# Altium schematic sheet Boost Converter Circuit.SchDoc
size B; Organization: Altium Limited; Address1: L3, 12a Rodborough Rd; Address2: Frenchs Forest; Address3: NSW; Address4: Australia 2086; SheetNumber: 1; SheetTotal: 1
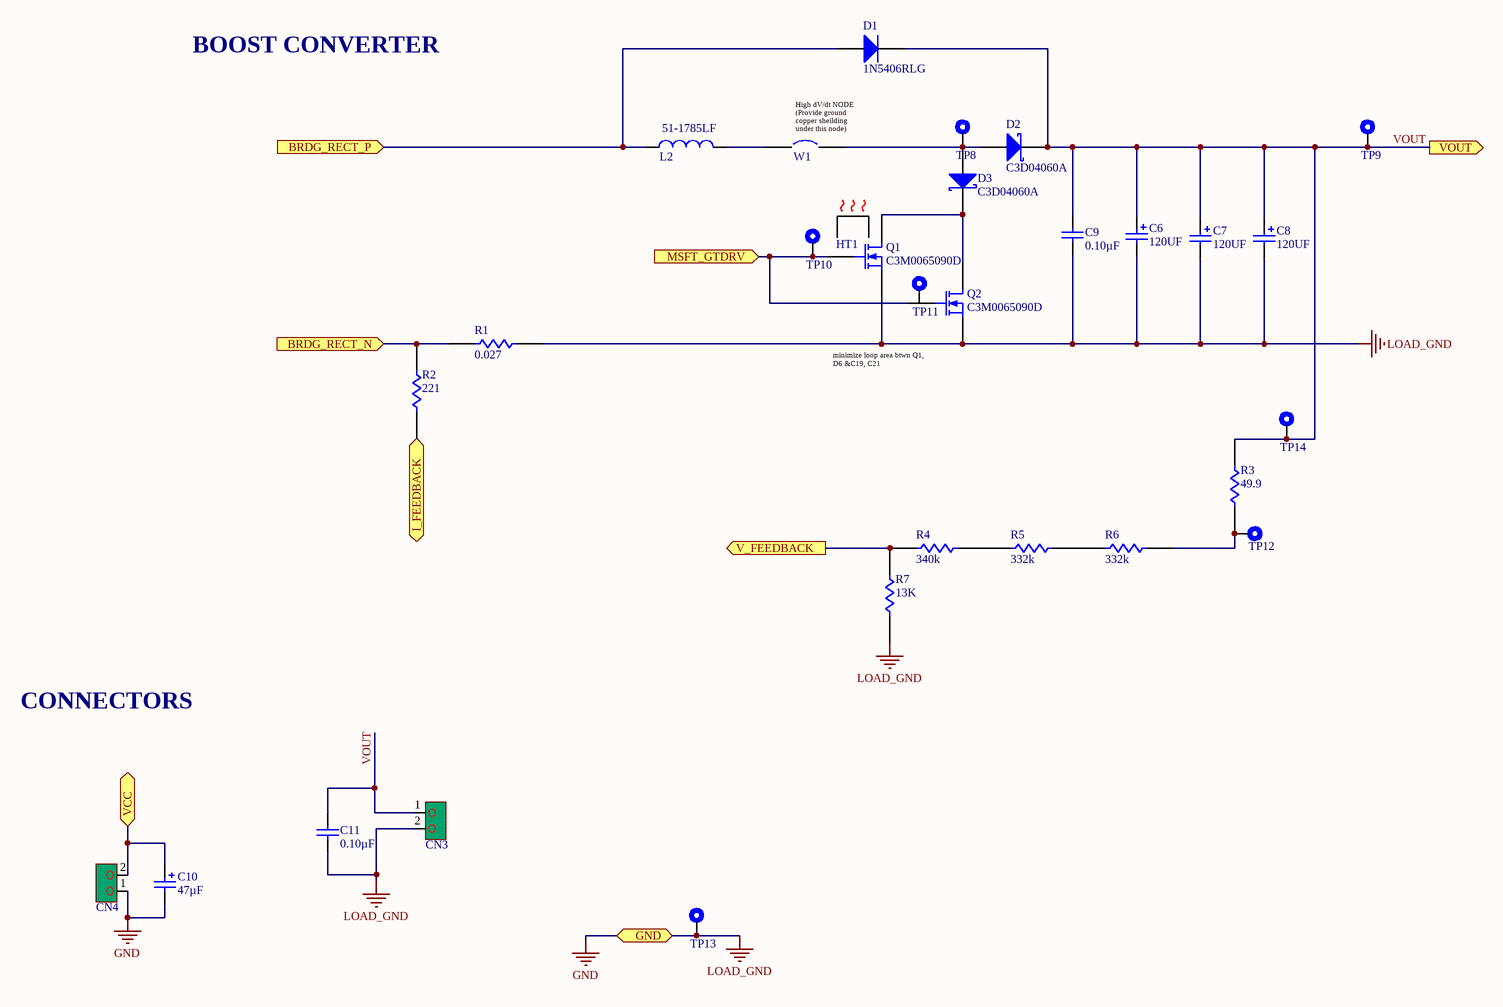
[diagram p0: Boost Converter Circuit.SchDoc]

## Parts
C6  Capacitance: 120UF  [450QXW120MEFC18X31.5]  (hidden comment: 450QXW120MEFC18X31.5)
C7  Capacitance: 120UF  [450QXW120MEFC18X31.5]  (hidden comment: 450QXW120MEFC18X31.5)
C8  Capacitance: 120UF  [450QXW120MEFC18X31.5]  (hidden comment: 450QXW120MEFC18X31.5)
C9  Capacitance: 0.10µF  [CAP1812]  (hidden comment: GRM43DR72J104KW01L)
C10  Capacitance: 47µF  [CAPALUM47U]  (hidden comment: ECA-1VM470)
C11  Capacitance: 0.10µF  [CAP1812]  (hidden comment: GRM43DR72J104KW01L)
CN3  1935776  [CONN_1935776]  (value not drawn)
CN4  1935776  [CONN_1935776]  (value not drawn)
D1  1N5406RLG  [1N5406-DO201AD]
D2  C3D04060A  [C3D04060A]
D3  C3D04060A  [C3D04060A]
HT1  HT_78245  [HT-78245]  (value not drawn)
L2  51-1785LF  [G-51-185LF]
Q1  C3M0065090D  [TO-247-3]
Q2  C3M0065090D  [TO-247-3]
R1  Resistance: 0.027  [RES2512]  (hidden comment: CRCW2512R0.027)
R2  Resistance: 221  [RES0805_New]  (hidden comment: RC0805FR-07221RL)
R3  Resistance (Ohms): 49.9  [RES1206]  (hidden comment: CRCW120649R9FKEA)
R4  Resistance (Ohms): 340k  [RES0805_New]  (hidden comment: CRCW0805340KFKEA)
R5  Resistance (Ohms): 332k  [RES0805_New]  (hidden comment: CRCW0805332KFKEA)
R6  Resistance (Ohms): 332k  [RES0805_New]  (hidden comment: CRCW0805332KFKEA)
R7  Resistance: 13K  [RES0805_New]  (hidden comment: RC0805FR-0713KL)
TP8  5006  [Test Point]  (value not drawn)
TP9  5006  [Test Point]  (value not drawn)
TP10  5006  [Test Point]  (value not drawn)
TP11  5006  [Test Point]  (value not drawn)
TP12  5006  [Test Point]  (value not drawn)
TP13  5006  [Test Point]  (value not drawn)
TP14  5006  [Test Point]  (value not drawn)
W1  Wire  [Current Sense Wire]  (value not drawn)

## Ports
BRDG_RECT_N (in), BRDG_RECT_P (in), GND, I_FEEDBACK, MSFT_GTDRV (in), V_FEEDBACK (out), VCC, VOUT (out)

## Nets
GND: C6.2 C7.2 C8.2 C9.1 C10.2 C11.1 CN3.2 CN4.1 Q1.3(S) Q2.3(S) R1.1 R7.2 TP13.1 ; port GND  [also labelled LOAD_GND]
BRDG_RECT_N: R1.2 R2.1 ; port BRDG_RECT_N
BRDG_RECT_P: D1.2(A) L2.1 ; port BRDG_RECT_P
I_FEEDBACK: R2.2 ; port I_FEEDBACK
MSFT_GTDRV: Q1.1(G) Q2.1(G) TP10.1 ; port MSFT_GTDRV
V_FEEDBACK: R4.2 R7.1 ; port V_FEEDBACK
VCC: C10.1 CN4.2 ; port VCC
VOUT: C6.1 C7.1 C8.1 C9.2 C11.2 CN3.1 D1.1(K) D2.1(K) R3.1 TP9.1 TP14.1 ; port VOUT
NetD2_2: D2.2(A) D3.2(A) TP8.1 W1.2
NetD3_1: D3.1(K) Q1.2(D) Q2.2(D)
NetL2_2: L2.2 W1.1
NetR3_2: R3.2 R6.1 TP12.1
NetR4_1: R4.1 R5.2
NetR5_1: R5.1 R6.2

Not connected (* = marked no-connect by the designer): TP11 1

## Notes on the sheet
- BOOST CONVERTER
- (near W1) High dV/dt NODE (Provide ground copper sheilding under this node)
- (near Q2) minimize loop area btwn Q1, D6 &C19, C21
- CONNECTORS
- Title:
- Size:
- B
- Document Number:
- Revision:
- Designer:
- Approval Date:
- Start Date:
- MM/DD/YY
- --/--/--
- Sheet:
- of
- Approver:
- CONFIDENTIAL
- Project Name/Number:

## Library data of the parts
C9 C11 = GRM43DR72J104KW01L: CAP CER 0.1UF 630V X7R 1812; Manufacturer 1: Murata Electronics North America; Category 1: Capacitors; Tolerance: ±10%; Supplier 1: Digi-Key; Supplier Part Number 1: 490-3518-1-ND; Manufacturer Part Number 1: GRM43DR72J104KW01L; RoHS 1: RoHS Compliant; Description 1: CAP CER 0.1UF 630V X7R 1812; Stock 1: 99604; Pricing 1: 1=0.84, 10=0.803, 50=0.4796, 100=0.3897, 250=0.32372, 500=0.29376 (USD); Packaging: Cut Tape (CT); Part Status: Active; Voltage - Rated: 630V; Temperature Coefficient: X7R; Operating Temperature: -55°C ~ 125°C; Features: -; Ratings: -; Applications: General Purpose; Mounting Type: Surface Mount, MLCC; Package / Case: 1812 (4532 Metric); Size / Dimension: 0.177" L x 0.126" W (4.50mm x 3.20mm); Height - Seated (Max): -; Thickness (Max): 0.087" (2.20mm); Lead Spacing: -; Lead Style: -; ComponentLink1URL: http://www.murata.com/~/media/webrenewal/support/library/catalog/products/capacitor/mlcc/c02e.pdf; ComponentLink1Description: http://www.murata.com/~/media/webrenewal/support/library/catalog/products/capacitor/mlcc/c02e.pdf
C10 = ECA-1VM470: CAP ALUM 47UF 20% 35V RADIAL; Manufacturer 1: Panasonic Electronic Components; Category 1: Capacitors; Lifetime @ Temp.: 2000 Hrs @ 85°C; Polarization: Polar; Ripple Current: 130mA @ 120Hz; Supplier 1: Digi-Key; Supplier Part Number 1: P5164-ND; Manufacturer Part Number 1: ECA-1VM470; RoHS 1: RoHS Compliant; Description 1: CAP ALUM 47UF 20% 35V RADIAL; Stock 1: 32051; Pricing 1: 1=0.19, 10=0.131, 25=0.0964, 50=0.0788, 100=0.0665, 250=0.05424, 500=0.0455, 1000=0.04025, 5000=0.035 (USD); Packaging: Bulk; Part Status: Active; Tolerance: ±20%; Voltage Rating: 35V; ESR (Equivalent Series Resistance): -; Operating Temperature: -40°C ~ 85°C; Applications: General Purpose; Impedance: -; Lead Spacing: 0.079" (2.00mm); Size / Dimension: 0.197" Dia (5.00mm); Height - Seated (Max): 0.472" (12.00mm); Surface Mount Land Size: -; Mounting Type: Through Hole; Package / Case: Radial, Can; ComponentLink1URL: http://industrial.panasonic.com/www-cgi/jvcr13pz.cgi?E+PZ+3+ABA0012+ECA1VM470+7+WW; ComponentLink1Description: http://industrial.panasonic.com/www-cgi/jvcr13pz.cgi?E+PZ+3+ABA0012+ECA1VM470+7+WW
CN3 CN4 = 1935776: CONN TERM BLOCK 2POS 5.0MM; Manufacturer 1: Phoenix Contact; Category 1: Connectors, Interconnects; Number of Levels: 1; Positions Per Level: 2; Pitch: 0.197" (5.00mm); Mating Orientation: Horizontal with Board; Current: 20A; Voltage: 300V; Wire Gauge: 12-20 AWG; Wire Termination: Screw; Torque - Screw: 0.45-0.5 Nm (3.9-4.4 Lb-In); Screw Thread: M3; Supplier 1: Digi-Key; Supplier Part Number 1: 277-6405-ND; Manufacturer Part Number 1: 1935776; RoHS 1: RoHS Compliant; Description 1: CONN TERM BLOCK 2POS 5.0MM; Stock 1: 5591; Pricing 1: 1=0.43, 10=0.411, 50=0.3928, 100=0.382, 250=0.357, 500=0.32844, 1000=0.2975 (USD); Packaging: Bulk; Part Status: Active; Mounting Type: Through Hole; Features: Interlocking (Side); Color: Green; Operating Temperature: -; Housing Material: Polyamide (PA), Nylon; Contact Material - Plating: -; Clamp Material - Plating: -; Screw Material - Plating: -; ComponentLink1URL: http://media.digikey.com/pdf/Data%20Sheets/Phoenix%20Contact%20PDFs/COMBICON%20Compact%20PT2,5.pdf; ComponentLink1Description: http://media.digikey.com/pdf/Data%20Sheets/Phoenix%20Contact%20PDFs/COMBICON%20Compact%20PT2,5.pdf
D1 = 1N5406RLG: DIODE GEN PURP 600V 3A DO201AD; Manufacturer: ON Semiconductor; Diode Type: Standard; Voltage - Forward (Vf) (Max) @ If: 1V @ 3A; Speed: Standard Recovery >500ns, > 200mA (Io); Current - Reverse Leakage @ Vr: 10µA @ 600V; Supplier 1: Digi-Key; RoHS: RoHS Compliant; Category: Discrete Semiconductor Products; Stock 1: 14400; Pricing 1: 1200=0.0966, 2400=0.08694, 6000=0.08211, 12000=0.07487, 30000=0.07004, 60000=0.06279 (USD); Packaging: Tape & Reel (TR); Part Status: Active; Capacitance @ Vr, F: -; Mounting Type: Through Hole; Package / Case: DO-201AA, DO-27, Axial; Supplier Device Package: DO-201AD; Operating Temperature - Junction: -65°C ~ 150°C; ComponentLink1URL: http://www.onsemi.com/pub_link/Collateral/1N5400-D.PDF; ComponentLink1Description: http://www.onsemi.com/pub_link/Collateral/1N5400-D.PDF; Supplier Part Number 1: 1N5406RLGOSTR-ND; Manufacturer Part Number: 1N5406RLG
D2 D3 = C3D04060A: DIODE SCHOTTKY 600V 4A TO220-2; Manufacturer 1: Cree/Wolfspeed; Category 1: Discrete Semiconductor Products; Diode Type: Silicon Carbide Schottky; Current - Average Rectified (Io): 4A (DC); Voltage - Forward (Vf) (Max) @ If: 1.8V @ 4A; Speed: No Recovery Time > 500mA (Io); Reverse Recovery Time (trr): 0ns; Current - Reverse Leakage @ Vr: 50µA @ 600V; Capacitance @ Vr, F: 251pF @ 0V, 1MHz; Supplier 1: Digi-Key; Supplier Part Number 1: C3D04060A-ND; RoHS 1: RoHS Compliant; Description 1: DIODE SCHOTTKY 600V 4A TO220-2; Stock 1: 1157; Pricing 1: 1=1.94, 100=1.62, 500=1.39, 1000=1.2125 (USD); Packaging: Tube; Part Status: Active; Voltage - DC Reverse (Vr) (Max): 600V; Mounting Type: Through Hole; Package / Case: TO-220-2; Supplier Device Package: TO-220-2; Operating Temperature - Junction: -55°C ~ 175°C; ComponentLink1URL: http://www.wolfspeed.com/media/downloads/845/C3D04060A.pdf; ComponentLink1Description: http://www.wolfspeed.com/media/downloads/845/C3D04060A.pdf; Manufacturer Part Number 1: C3D04060A
L2 = 51-1785LF: Manufacturer: Gowanda Electronics
Q1 Q2 = C3M0065090D: MOSFET N-CH 900V 36A TO247-3; Manufacturer 1: Cree/Wolfspeed; Category 1: Discrete Semiconductor Products; FET Type: N-Channel; Current - Continuous Drain (Id) @ 25°C: 36A (Tc); Drive Voltage (Max Rds On,  Min Rds On): 15V; Vgs(th) (Max) @ Id: 2.1V @ 5mA; Gate Charge (Qg) (Max) @ Vgs: 30.4nC @ 15V; Input Capacitance (Ciss) (Max) @ Vds: 660pF @ 600V; Vgs (Max): +18V, -8V; Power Dissipation (Max): 125W (Tc); Rds On (Max) @ Id, Vgs: 78 mOhm @ 20A, 15V; Supplier 1: Digi-Key; Supplier Part Number 1: C3M0065090D-ND; RoHS 1: RoHS Compliant; Description 1: MOSFET N-CH 900V 36A TO247-3; Stock 1: 4348; Pricing 1: 1=9.98, 100=9.62, 500=9.375 (USD); Packaging: Tube; Part Status: Active; Technology: SiCFET (Silicon Carbide); Drain to Source Voltage (Vdss): 900V; FET Feature: -; Operating Temperature: -55°C ~ 150°C (TJ); Mounting Type: Through Hole; Supplier Device Package: TO-247-3; Package / Case: TO-247-3; ComponentLink1URL: http://www.wolfspeed.com/media/downloads/176/C3M0065090D.pdf; ComponentLink1Description: http://www.wolfspeed.com/media/downloads/176/C3M0065090D.pdf; Manufacturer Part Number 1: C3M0065090D
R2 = RC0805FR-07221RL: RES SMD 221 OHM 1% 1/8W 0805; Manufacturer: Yageo; Power (Watts): 0.125W, 1/8W; Temperature Coefficient: ±100ppm/°C; Supplier 1: Digi-Key; Manufacturer Part Number: RC0805FR-07221RL; RoHS: RoHS Compliant; Category: Resistors; Stock 1: 823293; Pricing 1: 1=0.1, 10=0.022, 100=0.0088, 1000=0.00396, 2500=0.00344 (USD); Packaging: Cut Tape (CT); Part Status: Active; Tolerance: ±1%; Composition: Thick Film; Features: Moisture Resistant; Operating Temperature: -55°C ~ 155°C; Package / Case: 0805 (2012 Metric); Supplier Device Package: 0805; Size / Dimension: 0.079" L x 0.049" W (2.00mm x 1.25mm); Height - Seated (Max): 0.024" (0.60mm); Failure Rate: -; ComponentLink1URL: http://www.yageo.com/documents/recent/PYu-RC_Group_51_RoHS_L_7.pdf; ComponentLink1Description: http://www.yageo.com/documents/recent/PYu-RC_Group_51_RoHS_L_7.pdf; Supplier Part Number 1: 311-221CRCT-ND
R3 = CRCW120649R9FKEA: RES SMD 49.9 OHM 1% 1/4W 1206; Manufacturer 1: Vishay Dale; Category 1: Resistors; Power (Watts): 0.25W, 1/4W; Temperature Coefficient: ±100ppm/°C; Supplier 1: Digi-Key; Supplier Part Number 1: 541-49.9FCT-ND; Manufacturer Part Number 1: CRCW120649R9FKEA; RoHS 1: RoHS Compliant; Description 1: RES SMD 49.9 OHM 1% 1/4W 1206; Stock 1: 25160; Pricing 1: 1=0.1, 10=0.054, 25=0.0392, 50=0.03, 100=0.0221, 250=0.01684, 500=0.01346, 1000=0.00991 (USD); Packaging: Cut Tape (CT); Part Status: Active; Tolerance: ±1%; Composition: Thick Film; Features: Automotive AEC-Q200; Operating Temperature: -55°C ~ 155°C; Package / Case: 1206 (3216 Metric); Supplier Device Package: 1206; Size / Dimension: 0.126" L x 0.063" W (3.20mm x 1.60mm); Height - Seated (Max): 0.024" (0.60mm); Number of Terminations: 2; Failure Rate: -; ComponentLink1URL: http://www.vishay.com/docs/20035/dcrcwe3.pdf; ComponentLink1Description: http://www.vishay.com/docs/20035/dcrcwe3.pdf
R4 = CRCW0805340KFKEA: RES SMD 340K OHM 1% 1/8W 0805; Manufacturer 1: Vishay Dale; Category 1: Resistors; Power (Watts): 0.125W, 1/8W; Temperature Coefficient: ±100ppm/°C; Supplier 1: Digi-Key; Supplier Part Number 1: 541-340KCCT-ND; Manufacturer Part Number 1: CRCW0805340KFKEA; RoHS 1: RoHS Compliant; Description 1: RES SMD 340K OHM 1% 1/8W 0805; Stock 1: 2950; Pricing 1: 1=0.1, 10=0.04, 25=0.0288, 50=0.022, 100=0.0162, 250=0.01236, 500=0.0099, 1000=0.00729 (USD); Packaging: Cut Tape (CT); Part Status: Active; Tolerance: ±1%; Composition: Thick Film; Features: Automotive AEC-Q200; Operating Temperature: -55°C ~ 155°C; Package / Case: 0805 (2012 Metric); Supplier Device Package: 0805; Size / Dimension: 0.079" L x 0.049" W (2.00mm x 1.25mm); Height - Seated (Max): 0.020" (0.50mm); Number of Terminations: 2; Failure Rate: -; ComponentLink1URL: http://www.vishay.com/docs/20035/dcrcwe3.pdf; ComponentLink1Description: http://www.vishay.com/docs/20035/dcrcwe3.pdf
R5 R6 = CRCW0805332KFKEA: RES SMD 332K OHM 1% 1/8W 0805; Manufacturer 1: Vishay Dale; Category 1: Resistors; Power (Watts): 0.125W, 1/8W; Temperature Coefficient: ±100ppm/°C; Supplier 1: Digi-Key; Supplier Part Number 1: 541-332KCCT-ND; Manufacturer Part Number 1: CRCW0805332KFKEA; RoHS 1: RoHS Compliant; Description 1: RES SMD 332K OHM 1% 1/8W 0805; Stock 1: 14758; Pricing 1: 1=0.1, 10=0.04, 25=0.0288, 50=0.022, 100=0.0162, 250=0.01236, 500=0.0099, 1000=0.00729 (USD); Packaging: Cut Tape (CT); Part Status: Active; Tolerance: ±1%; Composition: Thick Film; Features: Automotive AEC-Q200; Operating Temperature: -55°C ~ 155°C; Package / Case: 0805 (2012 Metric); Supplier Device Package: 0805; Size / Dimension: 0.079" L x 0.049" W (2.00mm x 1.25mm); Height - Seated (Max): 0.020" (0.50mm); Number of Terminations: 2; Failure Rate: -; ComponentLink1URL: http://www.vishay.com/docs/20035/dcrcwe3.pdf; ComponentLink1Description: http://www.vishay.com/docs/20035/dcrcwe3.pdf
R7 = RC0805FR-0713KL: RES SMD 13K OHM 1% 1/8W 0805; Manufacturer: Yageo; Power (Watts): 0.125W, 1/8W; Temperature Coefficient: ±100ppm/°C; Supplier 1: Digi-Key; Manufacturer Part Number: RC0805FR-0713KL; RoHS: RoHS Compliant; Category: Resistors; Stock 1: 171259; Pricing 1: 1=0.1, 10=0.022, 100=0.0088, 1000=0.00396, 2500=0.00344 (USD); Packaging: Cut Tape (CT); Part Status: Active; Tolerance: ±1%; Composition: Thick Film; Features: Moisture Resistant; Operating Temperature: -55°C ~ 155°C; Package / Case: 0805 (2012 Metric); Supplier Device Package: 0805; Size / Dimension: 0.079" L x 0.049" W (2.00mm x 1.25mm); Height - Seated (Max): 0.024" (0.60mm); Failure Rate: -; ComponentLink1URL: http://www.yageo.com/documents/recent/PYu-RC_Group_51_RoHS_L_7.pdf; ComponentLink1Description: http://www.yageo.com/documents/recent/PYu-RC_Group_51_RoHS_L_7.pdf; Supplier Part Number 1: 311-13.0KCRCT-ND
TP8-TP14 = 5006: TEST POINT PC COMPACT .063"D BLK; Manufacturer 1: Keystone Electronics; Category 1: Test and Measurement; Plating: Silver; Material - Insulation: Nylon 46, UL 94V-0; Material - Body: Phosphor Bronze; Supplier 1: Digi-Key; Supplier Part Number 1: 36-5006-ND; Manufacturer Part Number 1: 5006; RoHS 1: RoHS Compliant; Description 1: TEST POINT PC COMPACT .063"D BLK; Stock 1: 199444; Pricing 1: 1=0.37, 10=0.316, 50=0.2298, 100=0.2209, 250=0.19832, 500=0.18932, 1000=0.1616, 2500=0.14424, 5000=0.13523 (USD); Packaging: Bulk; Part Status: Active; Type: PC Test Point, Compact; Mounting Type: 0.063" (1.60mm) Hole Diameter; Color: Black; Size / Dimension: 0.125" Dia x 0.220" L (3.18mm x 5.59mm); ComponentLink1URL: http://www.keyelco.com/product-pdf.cfm?p=1314; ComponentLink1Description: http://www.keyelco.com/product-pdf.cfm?p=1314